# Altium schematic sheet AC Power Supply.SchDoc: AC Power Supply
size A4; DrawnBy: Benjamin Williams; Address1: ECE Department; Address2: University of Canterbury; Address3: Christchurch 8041; Address4: New Zealand; Revision: 1; SheetNumber: 1; SheetTotal: 3
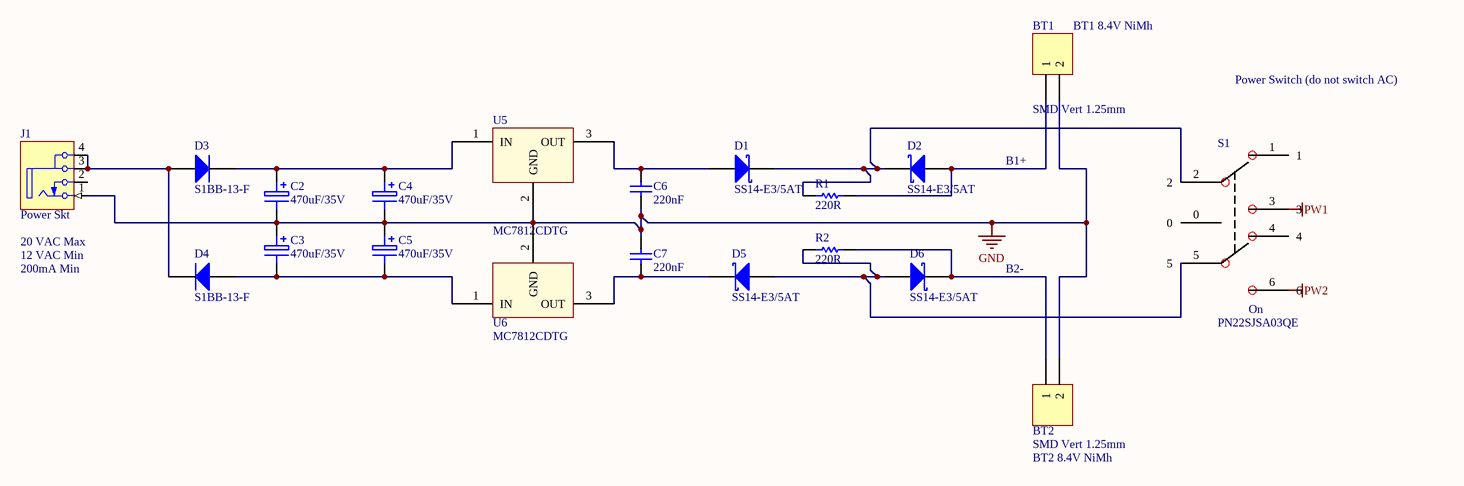
[diagram p0: AC Power Supply.SchDoc]

## Parts
BT1  SMD Vert 1.25mm  [SD-53398-0219]
BT2  SMD Vert 1.25mm  [SD-53398-0219]
C2  470uF/35V  [EEE-FK1V471SP]
C3  470uF/35V  [EEE-FK1V471SP]
C4  470uF/35V  [EEE-FK1V471SP]
C5  470uF/35V  [EEE-FK1V471SP]
C6  220nF  [CAPC1608L]
C7  220nF  [CAPC1608L]
D1  SS14-E3/5AT  [DIOM4227X23N]
D2  SS14-E3/5AT  [DIOM4227X23N]
D3  S1BB-13-F  [S1BB-13-F]
D4  S1BB-13-F  [S1BB-13-F]
D5  SS14-E3/5AT  [DIOM4227X23N]
D6  SS14-E3/5AT  [DIOM4227X23N]
J1  Power Skt  [1613_14]
R1  220R  [RESC1608L]
R2  220R  [RESC1608L]
S1  PN22SJSA03QE  [PN22SJSA03QE - duplicate]
U5  MC7812CDTG  [MC7812CDTRKG]
U6  MC7812CDTG  [MC7812CDTRKG]

## Nets
GND: BT1.2 BT2.2 C2.1 C3.2 C4.1 C5.2 C6.1 C7.2 J1.1(T) U5.2(GND) U6.2(GND)
NetBT1_1: BT1.1 D2.2(A) R1.2
NetBT2_1: BT2.1 D6.1(K) R2.2
NetC2_2: C2.2 C4.2 D3.3(K) U5.1(IN)
NetC3_1: C3.1 C5.1 D4.1(A) U6.1(IN)
NetC6_2: C6.2 D1.2(A) U5.3(OUT)
NetC7_1: C7.1 D5.1(K) U6.3(OUT)
NetD1_1: D1.1(K) D2.1(K) R1.1
NetD3_1: D3.1(A) D4.3(K) J1.3(S) J1.4(S)
NetD5_2: D5.2(A) D6.2(A) R2.1

Not connected (* = marked no-connect by the designer): J1 2(TN); S1 0 1 2 3 4 5 6

## Notes on the sheet
- (near BT1) BT1 8.4V NiMh
- Power Switch (do not switch AC)
- B1+
- (near J1) 20 VAC Max
- 12 VAC Min
- 200mA Min
- B2-
- BT2 8.4V NiMh
- Labels drawn without touching a wire or pin: PW1, PW2
- Title
- Drawn by:
- Date:
- Time:
- Revision:
- Sheet
- of
- File:
- (in symbol PN22SJSA03QE) On

## Library data of the parts
BT1 BT2 = JB_53398-02: Header_Vert_2Pos_1.25mm_125V@1A_SMT; Manufacturer: Molex Inc; Manufacturer Part Number: 0533980271; Number of Positions: 2; Pitch: 0.049" (1.25mm); Contact Type: Blade Pin; Mounting Type: Surface Mount; Supplier 1: Digi-Key; Supplier Part Number 1: WM7606CT-ND; Supplier: ECE Dept; Storage Location: PCB Assembly WS; Value: SMD Vert 1.25mm
C2-C5 = CA_470uF_16V: CAP ALUM 470uF 35V SMD; Manufacturer: Panasonic; Manufacturer PN: EEE-FK1V471SP; Supplier 1: Digi-Key; Supplier Part Number 1: P18963CT-ND; Storage Location: PCB Assembly WS; Supplier: ECE Dept; Value: 470uF/35V
C6 C7 = CC_220nF_0603: CAP CER 220nF Y5V -20% +80% 25V 0603; PackageReference: 0603; Code_IPC: 1608 [0603]; Verify: *; Supplier: ECE Dept; Storage Location: PCB Assembly WS; MoV: 25V; Value: 220nF
D1 D2 D5 D6 = DS_SS14E3: DIODE, SCHOTTKY, 1A, 40V, DO-214AC; Manufacturer: VISHAY GENERAL SEMICONDUCTOR; Diode Case Style: DO-214; Forward Current If(AV): 1; Diode Type: Schottky; Package / Case: SMA; Supplier 1: Digi-Key; Supplier Part Number 1: SS14-E3/5ATGICT-ND; Supplier 2: Farnell; Supplier Part Number 2: 9551280; Supplier 3: Mouser; Supplier Part Number 3: 625-SS14-E3/11T; Storage Location: PCB Assembly WS; Supplier: ECE Dept; Manufacturer Part Number: SS14-E3/5AT
D3 D4 = DR_BAS16TT1G: Diode Switching, Vr 75V, 200mA, SOT-416; Manufacturer: ON Semiconductor; Supplier 1: Digi-Key; Supplier Part Number 1: S1BB-FDICT-ND; Supplier 2: ECE Stock; Manufacturer PN: S1BB-13-F; Storage Location: PCB Assembly WS; Supplier: ECE Dept; Value: S1BB-13-F
J1 = JP_1613 14: Power supply chassis socket, SMD, Right Angle, with break contacts, 24V DC, 3.5A; Supplier 1: Farnell; Supplier Part Number 1: 1243245; Supplier: ECE Dept; Storage Location: PCB Assembly WS
R1 R2 = RS_220R: RES 220 OHM 1/10W 5% 0603 SMD; Storage Location: PCB Assembly WS; Supplier: ECE Dept; Value: 220R
U5 U6 = SV_TLV70233DBVR: IC REG LDO 3.3V 0.3A SOT23-5; Manufacturer: ON Semiconductor; Current - Output: 1A; Supplier 1: Digi-Key; Operating Temperature: 0°C ~ 125°C; Package / Case: DPAK-3; Pricing: 1=0.77, 10=0.647, 25=0.5672, 100=0.4853, 250=0.421, 500=0.35658, 750=0.30789, 1000=0.2749 (NZD); Supplier Part Number 1: MC7812CDTGOS-ND; Manufacturer Part Number: MC7812CDTG